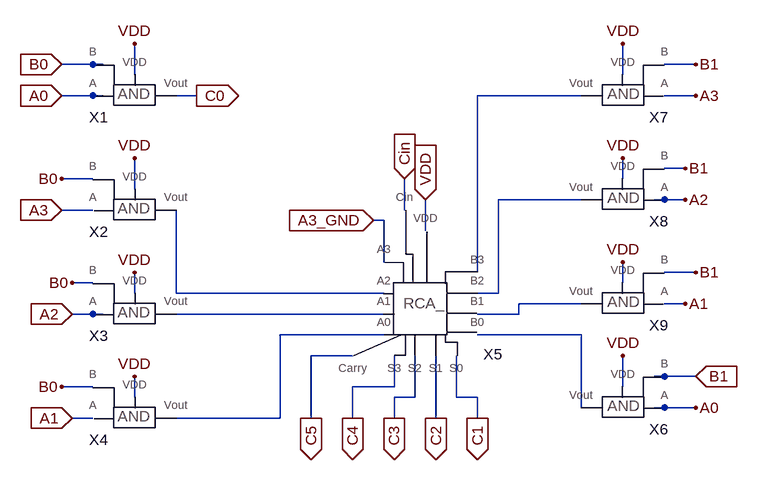
[diagram p0: schematic Mult_4_2_try.asc]
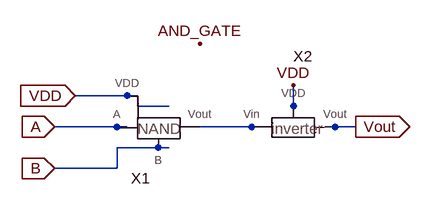
[diagram p1: sub-circuit and_gate.asc]
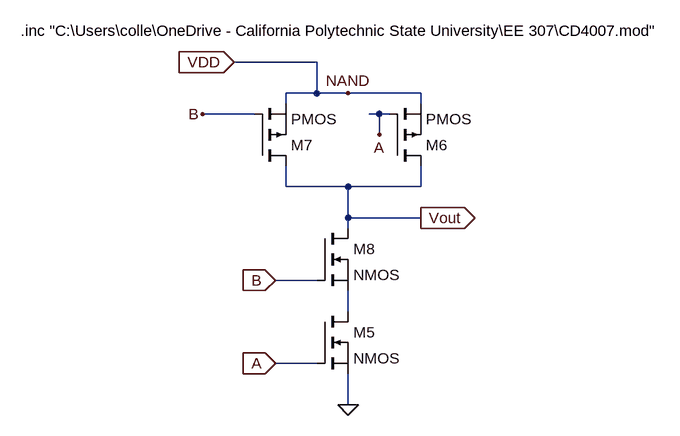
[diagram p2: sub-circuit nand_gate.asc]
Mult_4_2_try.asc, the LTspice schematic file:
Version 4
SHEET 1 1148 812
WIRE -128 80 -176 80
WIRE -112 80 -128 80
WIRE 800 80 752 80
WIRE -64 96 -64 48
WIRE 688 96 688 48
WIRE -128 128 -176 128
WIRE -112 128 -128 128
WIRE 32 128 0 128
WIRE 624 128 464 128
WIRE 800 128 752 128
WIRE 784 240 752 240
WIRE -128 256 -176 256
WIRE 688 256 688 224
WIRE -64 272 -64 224
WIRE 624 288 496 288
WIRE 752 288 736 288
WIRE 784 288 752 288
WIRE -128 304 -176 304
WIRE 352 304 352 256
WIRE 320 320 304 320
WIRE 384 336 384 288
WIRE 320 384 320 320
WIRE 464 400 464 128
WIRE 800 400 752 400
WIRE -128 416 -160 416
WIRE 688 416 688 384
WIRE -64 432 -64 400
WIRE 0 432 0 304
WIRE 320 432 0 432
WIRE 496 432 496 288
WIRE 496 432 464 432
WIRE 624 448 528 448
WIRE 784 448 752 448
WIRE -128 464 -160 464
WIRE -112 464 -128 464
WIRE 320 464 0 464
WIRE 528 464 528 448
WIRE 528 464 464 464
WIRE 320 496 160 496
WIRE 624 496 464 496
WIRE 272 528 208 528
WIRE 752 560 736 560
WIRE 800 560 752 560
WIRE -128 576 -176 576
WIRE 336 576 336 528
WIRE 336 576 272 576
WIRE 688 576 688 528
WIRE -64 592 -64 560
WIRE 368 592 368 528
WIRE 368 592 336 592
WIRE 432 592 432 528
WIRE 464 592 432 592
WIRE 624 608 624 496
WIRE 752 608 736 608
WIRE 800 608 752 608
WIRE -128 624 -160 624
WIRE 160 624 160 496
WIRE 160 624 0 624
WIRE 208 624 208 528
WIRE 272 624 272 576
WIRE 336 624 336 592
WIRE 400 624 400 528
WIRE 464 624 464 592
FLAG -176 80 B0
IOPIN -176 80 In
FLAG -176 256 B0
FLAG -160 416 B0
FLAG -176 576 B0
FLAG -176 128 A0
IOPIN -176 128 In
FLAG -176 304 A3
IOPIN -176 304 In
FLAG -160 464 A2
IOPIN -160 464 In
FLAG -160 624 A1
IOPIN -160 624 In
FLAG -64 224 VDD
FLAG -64 48 VDD
FLAG -64 400 VDD
FLAG -64 560 VDD
FLAG 384 288 VDD
IOPIN 384 288 In
FLAG 352 256 Cin
IOPIN 352 256 In
FLAG 304 320 A3_GND
IOPIN 304 320 In
FLAG 32 128 C0
IOPIN 32 128 Out
FLAG 464 624 C1
IOPIN 464 624 Out
FLAG 400 624 C2
IOPIN 400 624 Out
FLAG 336 624 C3
IOPIN 336 624 Out
FLAG 272 624 C4
IOPIN 272 624 Out
FLAG 208 624 C5
IOPIN 208 624 Out
FLAG 800 560 B1
IOPIN 800 560 In
FLAG 800 80 B1
FLAG 784 240 B1
FLAG 800 400 B1
FLAG 800 608 A0
FLAG 800 128 A3
FLAG 784 288 A2
FLAG 784 448 A1
FLAG 688 48 VDD
FLAG 688 528 VDD
FLAG 688 224 VDD
FLAG 688 384 VDD
SYMBOL AND_gate -32 128 R0
SYMATTR InstName X1
SYMBOL AND_gate -32 304 R0
SYMATTR InstName X2
SYMBOL AND_gate -32 464 R0
SYMATTR InstName X3
SYMBOL AND_gate -32 624 R0
SYMATTR InstName X4
SYMBOL RCA_ 368 496 R0
SYMATTR InstName X5
SYMBOL AND_gate 656 608 M0
SYMATTR InstName X6
SYMBOL AND_gate 656 128 M0
SYMATTR InstName X7
SYMBOL AND_gate 656 288 M0
SYMATTR InstName X8
SYMBOL AND_gate 656 448 M0
SYMATTR InstName X9

and_gate.asc, the sub-circuit schematic file:
Version 4
SHEET 1 880 680
WIRE 80 128 -16 128
WIRE 80 144 80 128
WIRE 128 144 80 144
WIRE 320 144 320 112
WIRE 320 160 320 144
WIRE 64 176 -48 176
WIRE 192 176 176 176
WIRE 256 176 192 176
WIRE 272 176 256 176
WIRE 384 176 368 176
WIRE 416 176 384 176
WIRE 128 208 48 208
WIRE 48 240 48 208
WIRE 48 240 -48 240
FLAG -16 128 VDD
IOPIN -16 128 In
FLAG -48 176 A
IOPIN -48 176 In
FLAG -48 240 B
IOPIN -48 240 In
FLAG 416 176 Vout
IOPIN 416 176 Out
FLAG 320 112 VDD
FLAG 176 48 AND_GATE
SYMBOL Nand_gate 160 192 R0
SYMATTR InstName X1
SYMBOL Inverter 352 192 R0
SYMATTR InstName X2

nand_gate.asc, the sub-circuit schematic file:
Version 4
SHEET 1 880 680
WIRE -224 -192 -352 -192
WIRE -224 -144 -224 -192
WIRE -224 -144 -272 -144
WIRE -176 -144 -224 -144
WIRE -64 -144 -176 -144
WIRE -272 -128 -272 -144
WIRE -64 -128 -64 -144
WIRE -320 -112 -400 -112
WIRE -128 -112 -144 -112
WIRE -112 -112 -128 -112
WIRE -128 -80 -128 -112
WIRE -272 0 -272 -32
WIRE -176 0 -272 0
WIRE -64 0 -64 -32
WIRE -64 0 -176 0
WIRE -176 48 -176 0
WIRE -64 48 -176 48
WIRE -176 64 -176 48
WIRE -224 144 -288 144
WIRE -176 192 -176 160
WIRE -224 272 -288 272
WIRE -176 336 -176 288
FLAG -176 -144 NAND
FLAG -176 336 0
FLAG -288 272 A
IOPIN -288 272 In
FLAG -128 -80 A
FLAG -400 -112 B
FLAG -288 144 B
IOPIN -288 144 In
FLAG -64 48 Vout
IOPIN -64 48 Out
FLAG -352 -192 VDD
IOPIN -352 -192 In
SYMBOL nmos -224 192 R0
SYMATTR InstName M5
SYMBOL pmos -112 -32 M180
SYMATTR InstName M6
SYMBOL pmos -320 -32 M180
SYMATTR InstName M7
SYMBOL nmos -224 64 R0
SYMATTR InstName M8
TEXT -680 -240 Left 2 !.inc "C:\\Users\\colle\\OneDrive - California Polytechnic State University\\EE 307\\CD4007.mod"

The netlist it stands for:
* Mult_4_2_try.asc
XX1 A0 VDD C0 B0 and_gate
XX2 A3 VDD N003 B0 and_gate
XX3 A2 VDD N005 B0 and_gate
XX4 A1 VDD N006 B0 and_gate
XX5 A3_GND N003 N005 N006 C4 C3 C2 C1 C5 N001 N002 VDD N004 N007 Cin RCA_  ; pins A3 A2 A1 A0 S3 S2 S1 S0 Carry B3 B2 VDD B1 B0 Cin
XX6 A0 VDD N007 B1 and_gate
XX7 A3 VDD N001 B1 and_gate
XX8 A2 VDD N002 B1 and_gate
XX9 A1 VDD N004 B1 and_gate

* block symbol definitions
.subckt and_gate A VDD Vout B
XX1 A B N001 VDD nand_gate
XX2 N001 VDD Vout Inverter  ; pins Vin VDD Vout
.ends and_gate

.subckt nand_gate A B Vout VDD
M5 N001 A 0 0 NMOS
M6 Vout A VDD VDD PMOS
M7 Vout B VDD VDD PMOS
M8 Vout B N001 N001 NMOS
.inc "C:\Users\colle\OneDrive - California Polytechnic State University\EE 307\CD4007.mod"
.ends nand_gate

.model NMOS NMOS
.model PMOS PMOS
.lib standard.mos
.backanno
.end